# Altium schematic sheet Regulation_Charging.SchDoc
size A3; Organization: Altium Limited; Address1: L3, 12a Rodborough Rd; Address2: Frenchs Forest; Address3: NSW; Address4: Australia 2086; DocumentNumber: 6; SheetNumber: 6; SheetTotal: 8
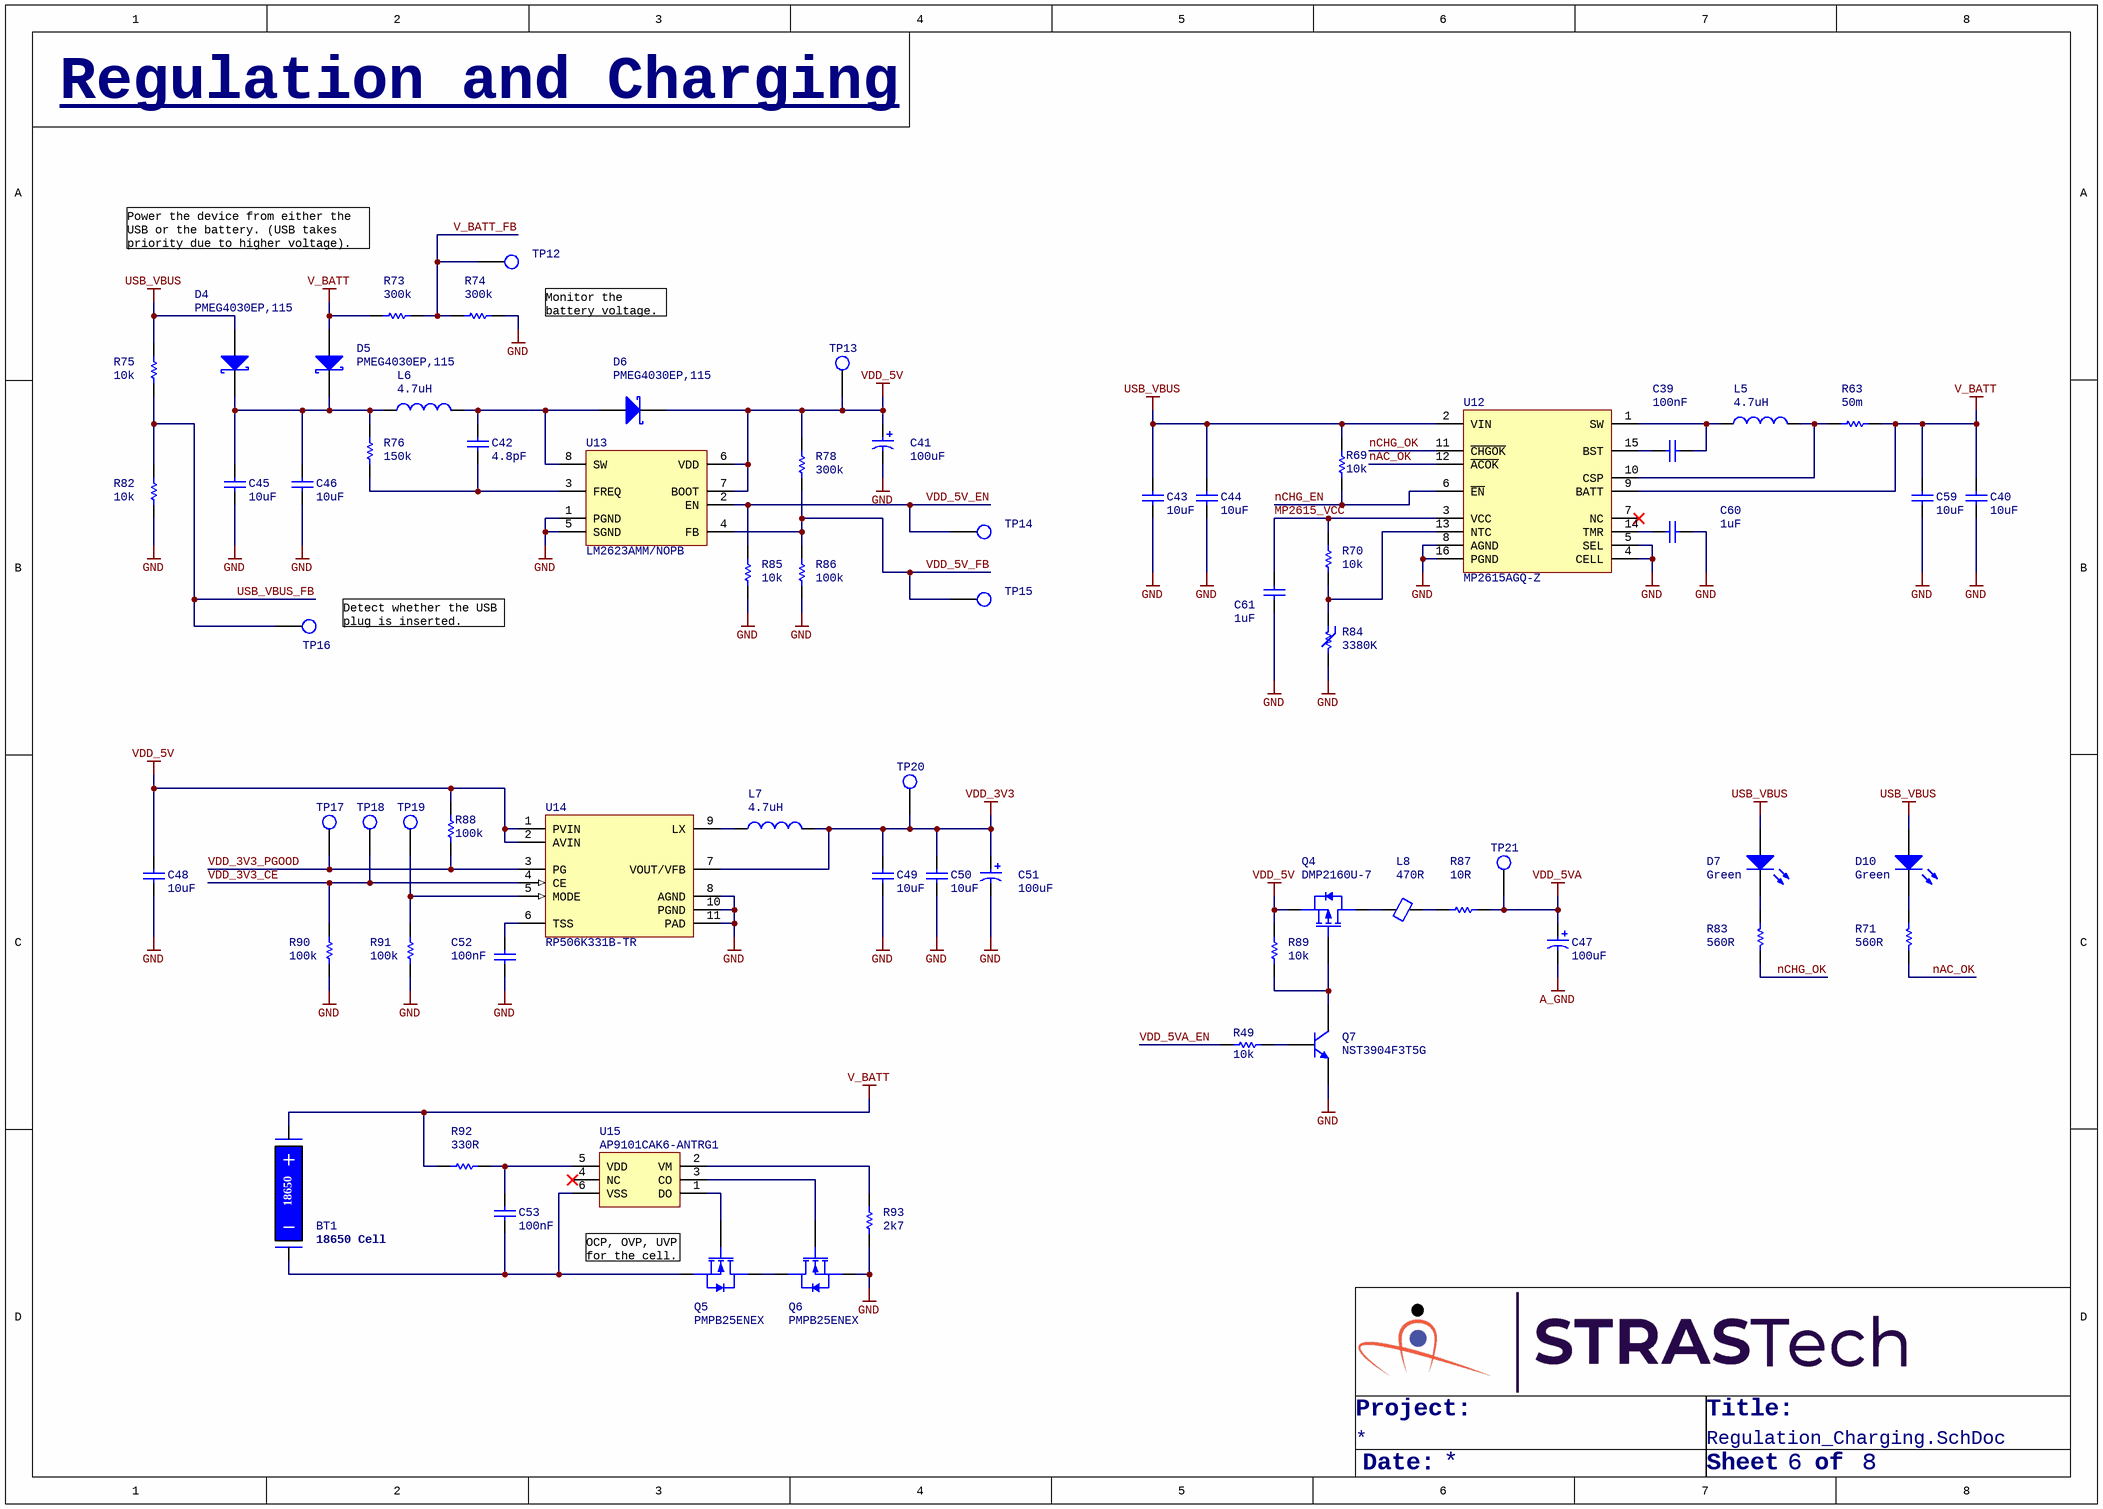
[diagram p0: Regulation_Charging.SchDoc]

## Parts
BT1  Holder,Cell,18650,SMD  [HOLDER,CELL,18650,SMD]  (value not drawn)
C39  100nF  [Cap,SMD,0402]
C40  10uF  [Cap,SMD,0402]
C41  100uF  [Cap,Alum,SMD,D5,H5.8]
C42  4.8pF  [Cap,SMD,0402]
C43  10uF  [Cap,SMD,0402]
C44  10uF  [Cap,SMD,0402]
C45  10uF  [Cap,SMD,0402]
C46  10uF  [Cap,SMD,0402]
C47  100uF  [Cap,Alum,SMD,D5,H5.8]
C48  10uF  [Cap,SMD,0402]
C49  10uF  [Cap,SMD,0402]
C50  10uF  [Cap,SMD,0402]
C51  100uF  [Cap,Alum,SMD,D5,H5.8]
C52  100nF  [Cap,SMD,0402]
C53  100nF  [Cap,SMD,0402]
C59  10uF  [Cap,SMD,0402]
C60  1uF  [Cap,SMD,0402]
C61  1uF  [Cap,SMD,0402]
D4  PMEG4030EP,115  [SOD128]
D5  PMEG4030EP,115  [SOD128]
D6  PMEG4030EP,115  [SOD128]
D7  Green  [LED,0603]
D10  Green  [LED,0603]
L5  4.7uH  [IND,WIREWOUND,4.9x4.9,SMD]
L6  4.7uH  [IND,WIREWOUND,4.9x4.9,SMD]
L7  4.7uH  [IND,WIREWOUND,4.9x4.9,SMD]
L8  470R  [IND,0402]
Q4  DMP2160U-7  [SOT23-3]
Q5  PMPB25ENEX  [IC,WDFN-6,P0.65]
Q6  PMPB25ENEX  [IC,WDFN-6,P0.65]
Q7  NST3904F3T5G  [SOT1123]
R49  10k  [RES,0402]
R63  50m  [RES,1206]
R69  10k  [RES,0402]
R70  10k  [RES,0402]
R71  560R  [RES,0402]
R73  300k  [RES,0402]
R74  300k  [RES,0402]
R75  10k  [RES,0402]
R76  150k  [RES,0402]
R78  300k  [RES,0402]
R82  10k  [RES,0402]
R83  560R  [RES,0402]
R84  3380K  [RES,0402]
R85  10k  [RES,0402]
R86  100k  [RES,0402]
R87  10R  [RES,0402]
R88  100k  [RES,0402]
R89  10k  [RES,0402]
R90  100k  [RES,0402]
R91  100k  [RES,0402]
R92  330R  [RES,0402]
R93  2k7  [RES,0402]
TP12  TESTPOINT  [testpoint,smd,round,1mm]  (value not drawn)
TP13  TESTPOINT  [testpoint,smd,round,1mm]  (value not drawn)
TP14  TESTPOINT  [testpoint,smd,round,1mm]  (value not drawn)
TP15  TESTPOINT  [testpoint,smd,round,1mm]  (value not drawn)
TP16  TESTPOINT  [testpoint,smd,round,1mm]  (value not drawn)
TP17  TESTPOINT  [testpoint,smd,round,1mm]  (value not drawn)
TP18  TESTPOINT  [testpoint,smd,round,1mm]  (value not drawn)
TP19  TESTPOINT  [testpoint,smd,round,1mm]  (value not drawn)
TP20  TESTPOINT  [testpoint,smd,round,1mm]  (value not drawn)
TP21  TESTPOINT  [testpoint,smd,round,1mm]  (value not drawn)
U12  MP2615AGQ-Z  [IC,QFN-16,3x3,P5x3]
U13  LM2623AMM/NOPB  [IC,TSSOP-8,W3.0]
U14  RP506K331B-TR  [IC,DFN-10_3x3,P0.5mm]
U15  AP9101CAK6-ANTRG1  [SOT23-6]

## Nets
A_GND: C47.2
GND: C40.1 C41.2 C43.1 C44.1 C45.1 C46.1 C48.1 C49.1 C50.1 C51.2 C52.1 C59.1 C60.2 C61.1 Q6.3(S) Q7.2(E) R74.1 R82.1 R84.2 R85.1 R86.1 R90.1 R91.2 R93.1 U12.4(CELL) U12.5(SEL) U12.8(AGND) U12.16(PGND) U13.1(PGND) U13.5(SGND) U14.8(AGND) U14.10(PGND) U14.11(PAD)
USB_VBUS: C43.2 C44.2 D4.2(A) D7.1(A) D10.1(A) R69.1 R75.2 U12.2(VIN)
V_BATT: BT1.1 C40.2 C59.2 D5.2(A) R63.2 R73.2 R92.1 U12.9(BATT)
VDD_3V3: C49.2 C50.2 C51.1 L7.2 TP20.1(TP) U14.7(VOUT/VFB)
VDD_5V: C41.1 C48.2 D6.1(K) Q4.2(S) R78.2 R88.2 R89.2 TP13.1(TP) U13.6(VDD) U13.7(BOOT) U14.1(PVIN) U14.2(AVIN)
VDD_5VA: C47.1 R87.2 TP21.1(TP)
MP2615_VCC: C61.2 R70.1 U12.3(VCC)
nAC_OK: R71.2 U12.12(~{ACOK})
nCHG_EN: R69.2 U12.6(~{EN})
nCHG_OK: R83.2 U12.11(~{CHGOK})
USB_VBUS_FB: R75.1 R82.2 TP16.1(TP)
V_BATT_FB: R73.1 R74.2 TP12.1(TP)
VDD_3V3_CE: R90.2 TP18.1(TP) U14.4(CE)
VDD_3V3_PGOOD: R88.1 TP17.1(TP) U14.3(PG)
VDD_5V_EN: R85.2 TP14.1(TP) U13.2(EN)
VDD_5V_FB: R78.1 R86.2 TP15.1(TP) U13.4(FB)
VDD_5VA_EN: R49.2
NetBT1_2: BT1.2 C53.1 Q5.3(S) U15.6(VSS)
NetC39_1: C39.1 L5.1 U12.1(SW)
NetC39_2: C39.2 U12.15(BST)
NetC42_1: C42.1 R76.1 U13.3(FREQ)
NetC42_2: C42.2 D6.2(A) L6.2 U13.8(SW)
NetC45_2: C45.2 C46.2 D4.1(K) D5.1(K) L6.1 R76.2
NetC52_2: C52.2 U14.6(TSS)
NetC53_2: C53.2 R92.2 U15.5(VDD)
NetC60_1: C60.1 U12.14(TMR)
NetD7_2: D7.2(K) R83.1
NetD10_2: D10.2(K) R71.1
NetL5_2: L5.2 R63.1 U12.10(CSP)
NetL7_1: L7.1 U14.9(LX)
NetL8_1: L8.1 Q4.3(D)
NetL8_2: L8.2 R87.1
NetQ4_1: Q4.1(G) Q7.3(C) R89.1
NetQ5_1: Q5.1(D) Q6.1(D)
NetQ5_2: Q5.2(G) U15.1(DO)
NetQ6_2: Q6.2(G) U15.3(CO)
NetQ7_1: Q7.1(B) R49.1
NetR70_2: R70.2 R84.1 U12.13(NTC)
NetR91_1: R91.1 TP19.1(TP) U14.5(MODE)
NetR93_2: R93.2 U15.2(VM)

Not connected (* = marked no-connect by the designer): U12 7(NC)*; U15 4(NC)*

## Notes on the sheet
- Regulation and Charging
- Power the device from either the USB or the battery. (USB takes priority due to higher voltage).
- Monitor the battery voltage.
- (near TP16) Detect whether the USB plug is inserted.
- (near BT1) 18650 Cell
- (near Q5) OCP, OVP, UVP for the cell.
- Project:
- Title:
- Date:
- Sheet
- of
- Title
- Size:
- A3
- Revision:
- Design By:
- (in symbol Holder,Cell,18650,SMD) 18650

## Library data of the parts
BT1 = Holder,Cell,18650,SMD: Battery Holder (Open) 18650 1 Cell SMD (SMT) Tab; Manufacturer: Keystone Electronics; Manufacturer Part Number: 1042; Vendor Part Number: 36-1042-ND; Vendor: Digikey; HelpURL: https://www.keyelco.com/userAssets/file/M65p27.pdf; CreatedBy: Judd Foster
C39 C52 C53 = CAP,Cer,100nF,25VDC,X7R,0402: 0.1µF ±10% 25V Ceramic Capacitor X7R 0402 (1005 Metric); Vendor Part Number: 490-14603-1-ND; Manufacturer: Murata Electronics; Manufacturer Part Number: GRM155R71E104KE14J; Vendor: Digikey; HelpURL: https://search.murata.co.jp/Ceramy/image/img/A01X/G101/ENG/GRM155R71E104KE14-01.pdf; CreatedBy: Judd Foster
C40 C43-C46 C48-C50 C59 = CAP,Cer,10uF,10VDC,X5R,0402: 10 µF ±20% 10V Ceramic Capacitor X5R 0402 (1005 Metric); Vendor Part Number: 1276-1450-1-ND; Manufacturer: Samsung Electro-Mechanics; Manufacturer Part Number: CL05A106MP5NUNC; Vendor: Digikey; HelpURL: https://media.digikey.com/pdf/Data%20Sheets/Samsung%20PDFs/CL05A106MP5NUNC_Spec.pdf; CreatedBy: Judd Foster
C41 C47 C51 = CAP,Alum,100uF,10VDC,SMD: CAP ALUM 100UF 20% 10V SMD; Vendor Part Number: PCE3867CT-ND; Manufacturer: Panasonic; Manufacturer Part Number: EEE-1AA101WR; Vendor: Digikey; HelpURL: https://media.digikey.com/pdf/Data%20Sheets/Panasonic%20Electronic%20Components/S_Series,Type_V_Rev2018.pdf; CreatedBy: Judd Foster
C42 = CAP,Cer,4.8pF,50VDC,C0G/NP0,0402: 4.8 pF ±0.25pF 50V Ceramic Capacitor C0G, NP0 0402 (1005 Metric); Vendor Part Number: 490-17481-1-ND; Manufacturer: Murata Electronics; Manufacturer Part Number: GCQ1555C1H4R8CB01D; Vendor: Digikey; HelpURL: https://search.murata.co.jp/Ceramy/image/img/A01X/G101/ENG/GCQ1555C1H4R8CB01-01.pdf; CreatedBy: Judd Foster
C60 C61 = CAP,Cer,1uF,35VDC,X5R,0402: 1 µF ±10% 35V Ceramic Capacitor X5R 0402 (1005 Metric); Vendor Part Number: 445-9073-1-ND; Manufacturer: TDK Corporation; Manufacturer Part Number: C1005X5R1V105K050BC; Vendor: Digikey; HelpURL: https://product.tdk.com/info/en/catalog/datasheets/mlcc_commercial_general_en.pdf?ref_disty=digikey; CreatedBy: Judd Foster
D4-D6 = DIODE,Schottky,40V,3A,SMD: Diode Schottky 40V 3A Surface Mount CFP5; Manufacturer: Nexperia USA Inc.; Vendor Part Number: 1727-5841-1-ND; Vendor: Digikey; CreatedBy: Judd Foster; HelpURL: https://assets.nexperia.com/documents/data-sheet/PMEG4030EP.pdf; Manufacturer Part Number: PMEG4030EP,115
D7 D10 = LED,Green,SMD,0603: Green 530nm LED Indication - Discrete 3V 0603 (1608 Metric); Manufacturer: Stanley Electric Co; Manufacturer Part Number: THG1111C-0005-TR; Vendor Part Number: 404-1286-1-ND; Vendor: Digikey; CreatedBy: Judd Foster; HelpURL: http://www.stanley-components.com/php/downloaddatafile.php?rp=0,THG1111C-0005_e.pdf
L5-L7 = IND,4.7uH,2.6A,Wirewound,SMD: 4.7µH Shielded Wirewound Inductor 2.6A 45.5mOhm Max Nonstandard; Vendor Part Number: 587-3605-1-ND; Manufacturer: Taiyo Yuden; Manufacturer Part Number: NRS5030T4R7MMGJV; Vendor: Digikey; HelpURL: https://ds.yuden.co.jp/TYCOMPAS/ut/detail?pn=NRS5030T4R7MMGJV%20%20&u=M; CreatedBy: Judd Foster
L8 = Ferrite,470R@100MHz,0402: 470 Ohms @ 100 MHz 1 Power Line Ferrite Bead 0402 (1005 Metric) 1A 200mOhm; Vendor Part Number: 490-10662-1-ND; Manufacturer: Murata Electronics; Manufacturer Part Number: BLM15PX471SN1D; Vendor: Digikey; HelpURL: https://www.murata.com/en-us/products/productdata/8796740059166/ENFA0018.pdf; CreatedBy: Judd Foster
Q4 = MOSFET,P Ch,20V,3.2A: P-Channel 20 V 3.2A (Ta) 1.4W (Ta) Surface Mount SOT-23-3; Manufacturer: Diodes Incorporated; Vendor Part Number: DMP2160UDICT-ND; Vendor: Digikey; CreatedBy: Judd Foster; HelpURL: https://media.digikey.com/pdf/Data%20Sheets/Diodes%20PDFs/DMP2160U.pdf; Manufacturer Part Number: DMP2160U-7
Q5 Q6 = MOSFET,N Ch,30V,10A: N-Channel 30 V 10A (Ta) 2.1W (Ta) Surface Mount DFN2020MD-6; Manufacturer: Nexperia USA Inc.; Vendor Part Number: 1727-7662-1-ND; Vendor: Digikey; CreatedBy: Ritesh Nandakumar; HelpURL: https://assets.nexperia.com/documents/data-sheet/PMPB25ENE.pdf; Manufacturer Part Number: PMPB25ENEX
Q7 = Trans,NPN,40V,200mA,SOT1123: Bipolar (BJT) Transistor NPN 40 V 200 mA 200MHz 290 mW Surface Mount SOT-1123; Manufacturer: ON Semiconductor; Vendor Part Number: NST3904F3T5GOSCT-ND; Vendor: Digikey; CreatedBy: Judd Foster; HelpURL: https://www.onsemi.com/pdf/datasheet/nst3904f3-d.pdf; Manufacturer Part Number: NST3904F3T5G
R49 R69 R70 R75 R82 R85 R89 = RES,10k,5%,0.063W,0402: 10 kOhms ±5% 0.063W, 1/16W Chip Resistor 0402 (1005 Metric) Automotive AEC-Q200 Thick Film; Vendor Part Number: RMCF0402JT10K0CT-ND; Manufacturer: Stackpole Electronics Inc; Manufacturer Part Number: RMCF0402JT10K0; Vendor: DIgikey; HelpURL: https://www.seielect.com/catalog/sei-rmcf_rmcp.pdf; CreatedBy: Judd Foster
R63 = RES,50m,1%,0.5W,1206: 50 mOhms ±1% 0.5W, 1/2W Chip Resistor 1206 (3216 Metric) Current Sense Metal Film; Manufacturer: Ohmite; Manufacturer Part Number: KDV12FR050ET; Vendor Part Number: 273-KDV12FR050ETCT-ND; Vendor: Digikey; CreatedBy: Judd Foster; HelpURL: https://www.ohmite.com/assets/docs/res_kdv.pdf?r=false
R71 R83 = RES,560R,1%,0.063W,0402: 560 Ohms ±1% 0.063W, 1/16W Chip Resistor 0402 (1005 Metric) Automotive AEC-Q200, Moisture Resistant Thick Film; Manufacturer: TE Connectivity Passive Product; Manufacturer Part Number: CRGCQ0402F560R; Vendor Part Number: A129624CT-ND; Vendor: Digikey; CreatedBy: Judd Foster; HelpURL: https://www.te.com/commerce/DocumentDelivery/DDEController?Action=srchrtrv&DocNm=1773204-3&DocType=DS&DocLang=English
R73 R74 R78 = RES,300k,1%,0.063W,0402: 300 kOhms ±1% 0.063W, 1/16W Chip Resistor 0402 (1005 Metric) Automotive AEC-Q200 Thick Film; Manufacturer: Stackpole Electronics Inc; Manufacturer Part Number: RMCF0402FT300K; Vendor Part Number: RMCF0402FT300KCT-ND; Vendor: Digikey; CreatedBy: Judd Foster; HelpURL: https://www.seielect.com/catalog/sei-rmcf_rmcp.pdf
R76 = RES,150k,1%,0.1W,0402: 150 kOhms ±1% 0.063W, 1/16W Chip Resistor 0402 (1005 Metric) Automotive AEC-Q200 Thick Film; Manufacturer: Stackpole Electronics Inc; Manufacturer Part Number: RMCF0402FT150K; Vendor Part Number: RMCF0402FT150KCT-ND; Vendor: Digikey; CreatedBy: Judd Foster; HelpURL: https://www.seielect.com/catalog/sei-rmcf_rmcp.pdf
R84 = RES,Thermistor,3380K,0402: NTC Thermistor 10k 0402 (1005 Metric); Manufacturer: Murata Electronics; Manufacturer Part Number: NCU15XH103J6SRC; Vendor Part Number: 490-NCU15XH103J6SRCCT-ND; Vendor: Digikey; CreatedBy: Judd Foster; HelpURL: https://www.murata.com/en-us/api/pdfdownloadapi?cate=luNTCforTempeSenso&partno=NCU15XH103J6SRC
R86 R88 R90 R91 = RES,100k,5%,0.1W,0402: 100 kOhms ±5% 0.1W, 1/10W Chip Resistor 0402 (1005 Metric) Automotive AEC-Q200 Thick Film; Manufacturer: Panasonic Electronic Components; Manufacturer Part Number: ERJ-2GEJ104X; Vendor Part Number: P100KJCT-ND; Vendor: Digikey; CreatedBy: Judd Foster; HelpURL: https://b2b-api.panasonic.eu/file_stream/pids/fileversion/1242
R87 = RES,10R,1%,0.063W,0402: 10 Ohms ±1% 0.063W, 1/16W Chip Resistor 0402 (1005 Metric) Automotive AEC-Q200 Thick Film; Manufacturer: Panasonic Electronic Components; Manufacturer Part Number: ERJ-2RKF10R0X; Vendor Part Number: P10.0LCT-ND; Vendor: Digikey; CreatedBy: Judd Foster; HelpURL: https://industrial.panasonic.com/cdbs/www-data/pdf/RDA0000/AOA0000C304.pdf
R92 = RES,330R,5%,0.063W,0402: 330 Ohms ±5% 0.063W, 1/16W Chip Resistor 0402 (1005 Metric) Automotive AEC-Q200 Thick Film; Manufacturer: Stackpole Electronics Inc; Manufacturer Part Number: RMCF0402JT330R; Vendor Part Number: RMCF0402JT330RCT-ND; Vendor: Digikey; CreatedBy: Judd Foster; HelpURL: https://www.seielect.com/catalog/sei-rmcf_rmcp.pdf
R93 = RES,2k7,1%,0.063W,0402: 2.7 kOhms ±1% 0.063W, 1/16W Chip Resistor 0402 (1005 Metric) Automotive AEC-Q200 Thick Film; Manufacturer: Stackpole Electronics Inc; Manufacturer Part Number: RMCF0402FT2K70; Vendor Part Number: RMCF0402FT2K70CT-ND; Vendor: Digikey; CreatedBy: Judd Foster; HelpURL: https://www.seielect.com/catalog/sei-rmcf_rmcp.pdf
TP12-TP21 = TESTPOINT: PCB Testpoint; CreatedBy: Judd Foster; HelpURL: N/A; Manufacturer: N/A; Manufacturer Part Number: N/A; Vendor: N/A; Vendor Part Number: N/A
U12 = MP2615AGQ-Z: Charger IC Lithium Ion/Polymer 16-QFN (3x3); Manufacturer: Monolithic Power Systems Inc.; Vendor Part Number: 1589-MP2615AGQ-ZCT-ND; Vendor: Digikey; CreatedBy: Judd Foster; HelpURL: https://www.monolithicpower.com/en/documentview/productdocument/index/version/2/document_type/Datasheet/lang/en/sku/MP2615AGQ-Z/document_id/1433/; Manufacturer Part Number: MP2615AGQ-Z
U13 = LM2623AMM/NOPB: Boost Switching Regulator IC Positive Adjustable 1.24V 1 Output 2.2A (Switch) 8-TSSOP, 8-MSOP (0.118", 3.00mm Width); Vendor Part Number: LM2623AMM/NOPBCT-ND; Manufacturer: Texas Instruments; Vendor: Digikey; Manufacturer Part Number: LM2623AMM/NOPB; HelpURL: https://www.ti.com/general/docs/suppproductinfo.tsp?distId=10&gotoUrl=https%3A%2F%2Fwww.ti.com%2Flit%2Fgpn%2Flm2623; CreatedBy: Judd Foster
U14 = RP506K331B-TR: Buck Switching Regulator IC Positive Fixed 3.3V 1 Output 2A 10-UFDFN Exposed Pad; Manufacturer: Nisshinbo Micro Devices Inc.; Vendor Part Number: 2129-RP506K331B-CT-ND; Vendor: Digikey; CreatedBy: Judd Foster; HelpURL: https://www.nisshinbo-microdevices.co.jp/en/pdf/datasheet/rp506-ea.pdf; Manufacturer Part Number: RP506K331B-TR
U15 = AP9101CAK6-ANTRG1: Battery Battery Protection IC Lithium Ion/Polymer SOT-26; Manufacturer: Diodes Incorporated; Vendor Part Number: AP9101CAK6-ANTRG1DICT-ND; Vendor: Digikey; CreatedBy: Judd Foster; HelpURL: https://www.diodes.com/assets/Datasheets/AP9101C.pdf; Manufacturer Part Number: AP9101CAK6-ANTRG1